# EAGLE design raspberry-alarm-clock-v1 (EAGLE 5.12)

## Sheet 1 of 7
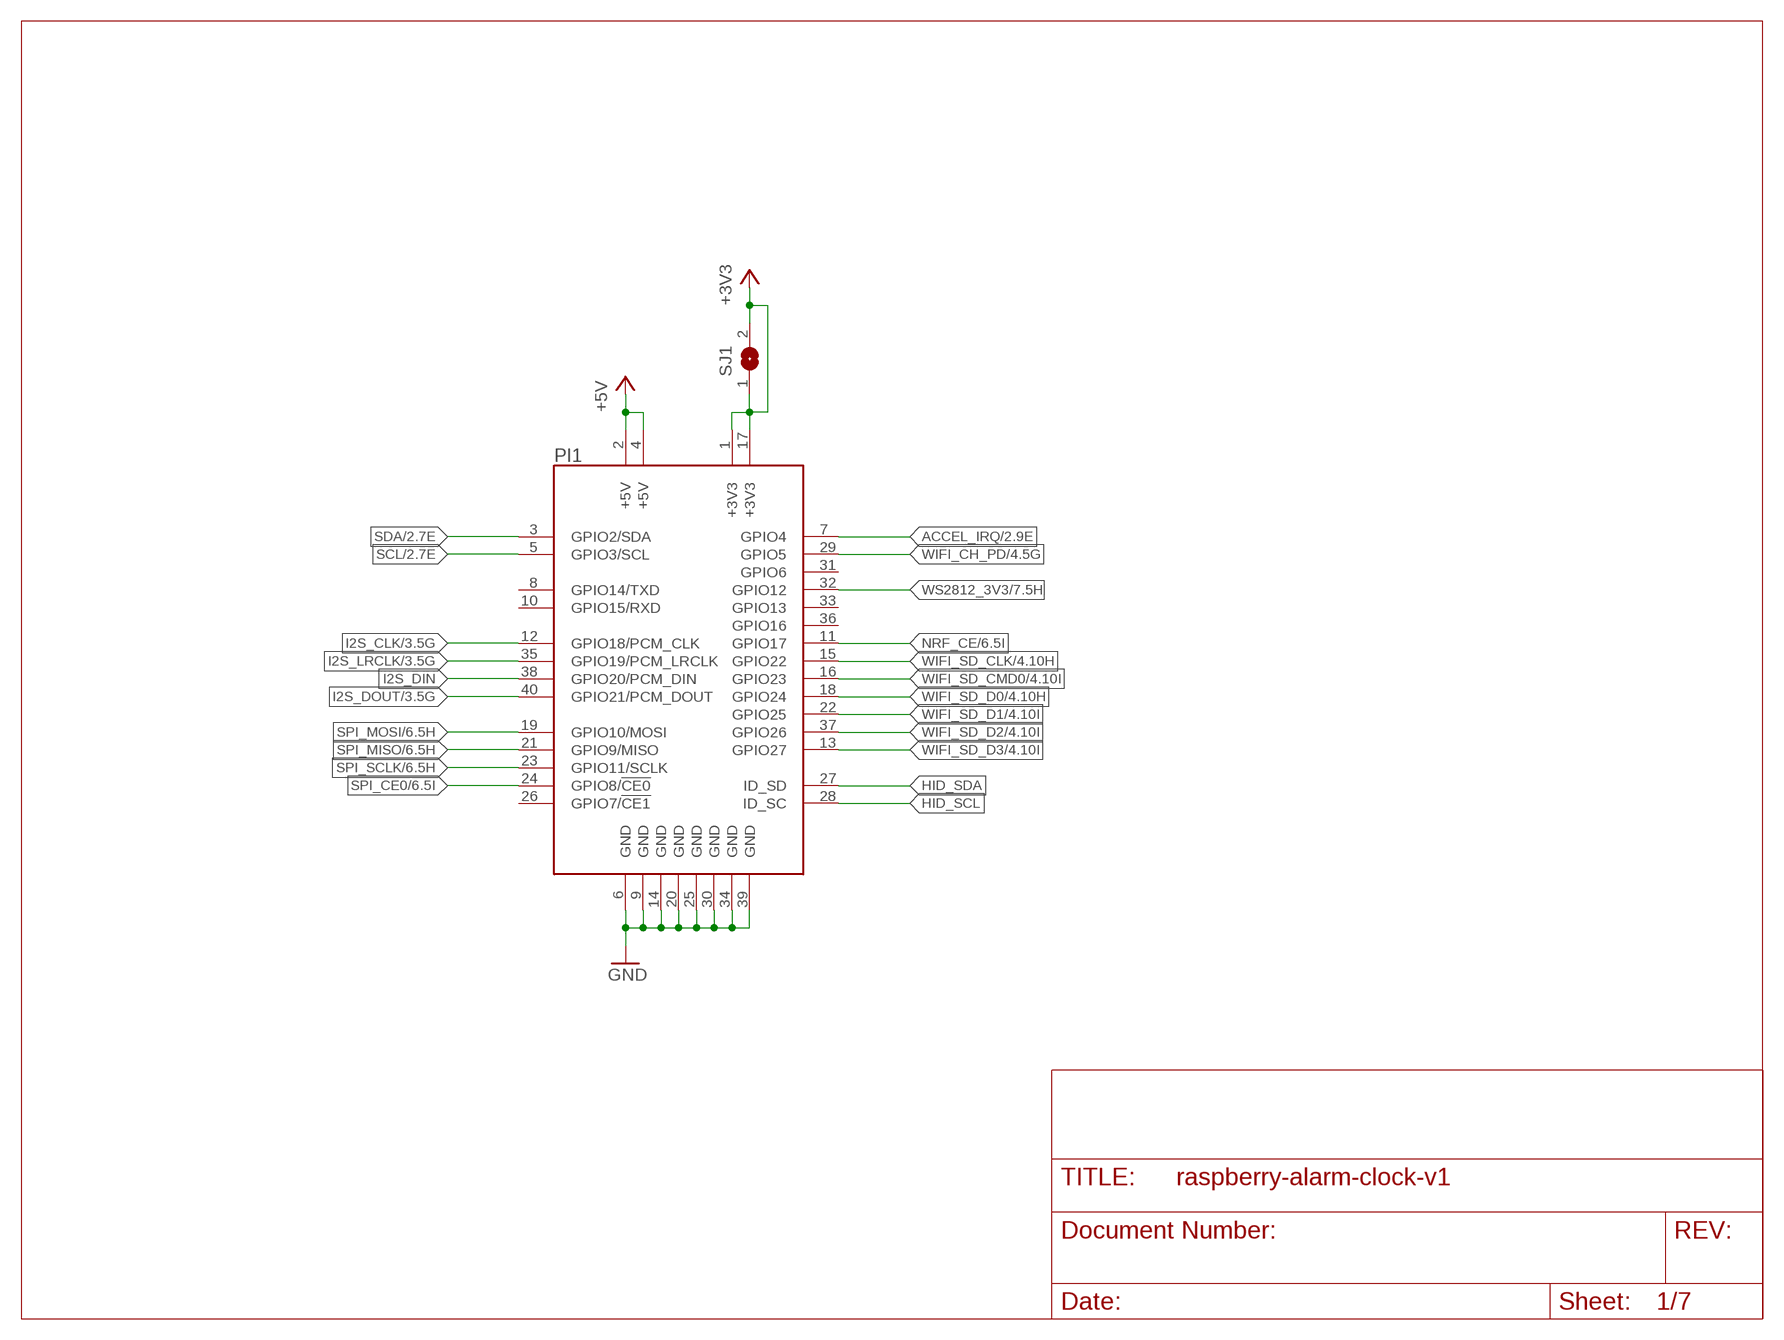
[diagram p0: schematic, sheet 1]

### Parts
PI1  PIHAT-REVERSE-COMBO  [PIHAT-REVERSE-COMBO]
SJ1  SJ  [SJ]

### Nets
+3V3: PI1.1(+3V3) PI1.17(+3V3) SJ1.1 SJ1.2 ; also sheet 2,4,6
+5V: PI1.2(+5V) PI1.4(+5V) ; also sheet 3,5,7
ACCEL_IRQ: PI1.7(GPIO4) ; also sheet 2
GND: PI1.6(GND) PI1.9(GND) PI1.14(GND) PI1.20(GND) PI1.25(GND) PI1.30(GND) PI1.34(GND) PI1.39(GND) ; also sheet 2,3,4,5,6,7
HID_SCL: PI1.28(ID_SC)
HID_SDA: PI1.27(ID_SD)
I2S_CLK: PI1.12(GPIO18/PCM_CLK) ; also sheet 3
I2S_DIN: PI1.38(GPIO20/PCM_DIN)
I2S_DOUT: PI1.40(GPIO21/PCM_DOUT) ; also sheet 3
I2S_LRCLK: PI1.35(GPIO19/PCM_LRCLK) ; also sheet 3
NRF_CE: PI1.11(GPIO17) ; also sheet 6
SCL: PI1.5(GPIO3/SCL) ; also sheet 2
SDA: PI1.3(GPIO2/SDA) ; also sheet 2
SPI_CE0: PI1.24(GPIO8/!CE0) ; also sheet 6
SPI_MISO: PI1.21(GPIO9/MISO) ; also sheet 6
SPI_MOSI: PI1.19(GPIO10/MOSI) ; also sheet 6
SPI_SCLK: PI1.23(GPIO11/SCLK) ; also sheet 6
WIFI_CH_PD: PI1.29(GPIO5) ; also sheet 4
WIFI_SD_CLK: PI1.15(GPIO22) ; also sheet 4
WIFI_SD_CMD0: PI1.16(GPIO23) ; also sheet 4
WIFI_SD_D0: PI1.18(GPIO24) ; also sheet 4
WIFI_SD_D1: PI1.22(GPIO25) ; also sheet 4
WIFI_SD_D2: PI1.37(GPIO26) ; also sheet 4
WIFI_SD_D3: PI1.13(GPIO27) ; also sheet 4
WS2812_3V3: PI1.32(GPIO12) ; also sheet 7
Unconnected: PI1.8(GPIO14/TXD) PI1.10(GPIO15/RXD) PI1.26(GPIO7/!CE1) PI1.31(GPIO6) PI1.33(GPIO13) PI1.36(GPIO16)

## Sheet 2 of 7
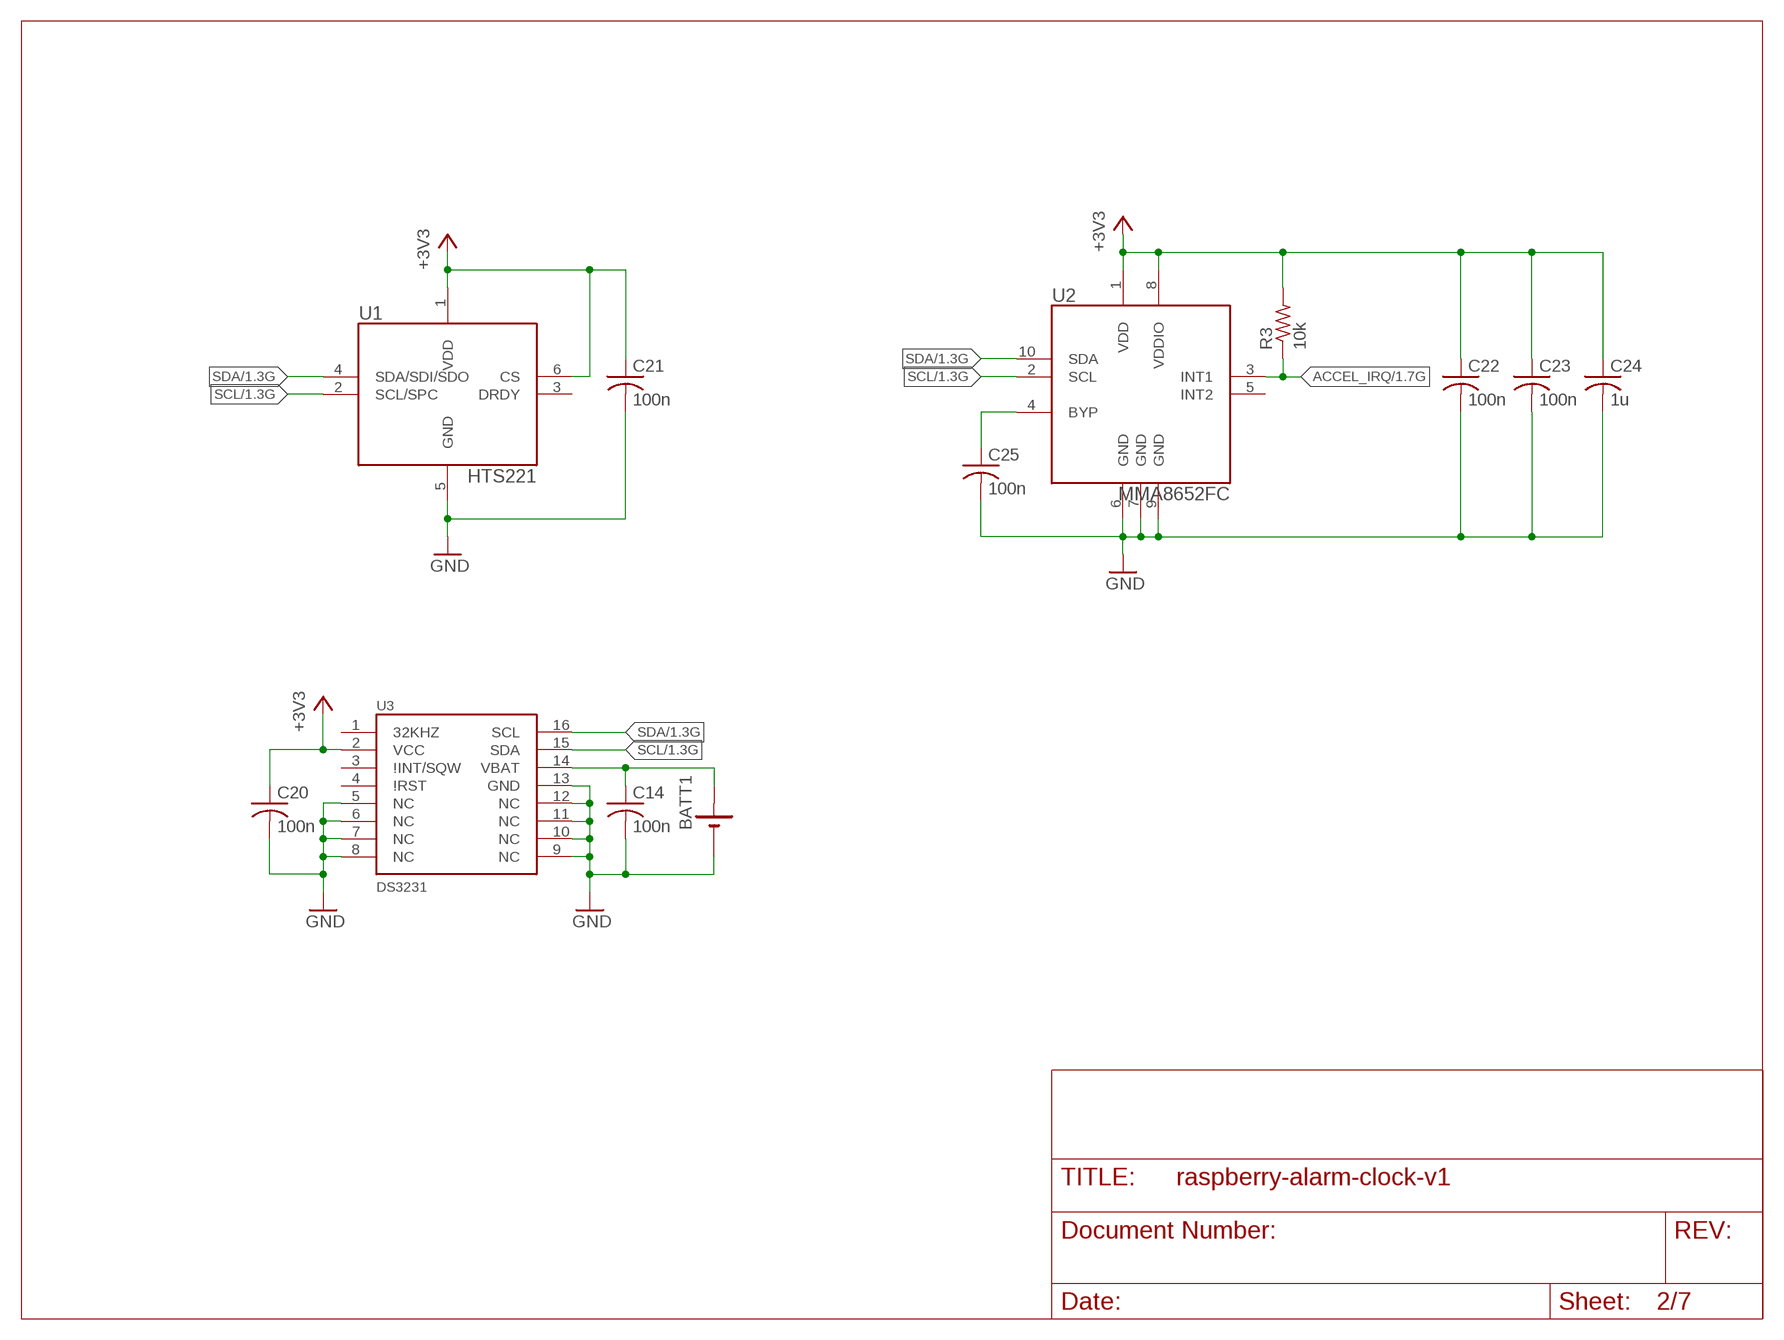
[diagram p1: schematic, sheet 2]

### Parts
BATT1  2032SMD  [2032SMD]
C14  100n  C-USC0603  [C0603]
C20  100n  C-USC0603  [C0603]
C21  100n  C-USC0603  [C0603]
C22  100n  C-USC0603  [C0603]
C23  100n  C-USC0603  [C0603]
C24  1u  C-USC0603  [C0603]
C25  100n  C-USC0603  [C0603]
R3  10k  R-US_R0603  [R0603]
U1  HTS221  [HLGA-6L]
U2  MMA8652FC  [DFN-10]
U3  DS3231  [SO16W]

### Nets
+3V3: C20.1 C21.1 C22.1 C23.1 C24.1 R3.2 U1.1(VDD) U1.6(CS) U2.1(VDD) U2.8(VDDIO) U3.2(VCC) ; also sheet 1,4,6
ACCEL_IRQ: R3.1 U2.3(INT1) ; also sheet 1
GND: BATT1.- C14.2 C20.2 C21.2 C22.2 C23.2 C24.2 C25.2 U1.5(GND) U2.6(GND) U2.7(GND) U2.9(GND) U3.5(NC) U3.6(NC) U3.7(NC) U3.8(NC) U3.9(NC) U3.10(NC) U3.11(NC) U3.12(NC) U3.13(GND) ; also sheet 1,3,4,5,6,7
N$16: BATT1.+ C14.1 U3.14(VBAT)
N$17: C25.1 U2.4(BYP)
SCL: U1.2(SCL/SPC) U2.2(SCL) U3.15(SDA) ; also sheet 1
SDA: U1.4(SDA/SDI/SDO) U2.10(SDA) U3.16(SCL) ; also sheet 1
Unconnected: U1.3(DRDY) U2.5(INT2) U3.1(32KHZ) U3.3(\!INT/SQW) U3.4(\!RST)

## Sheet 3 of 7
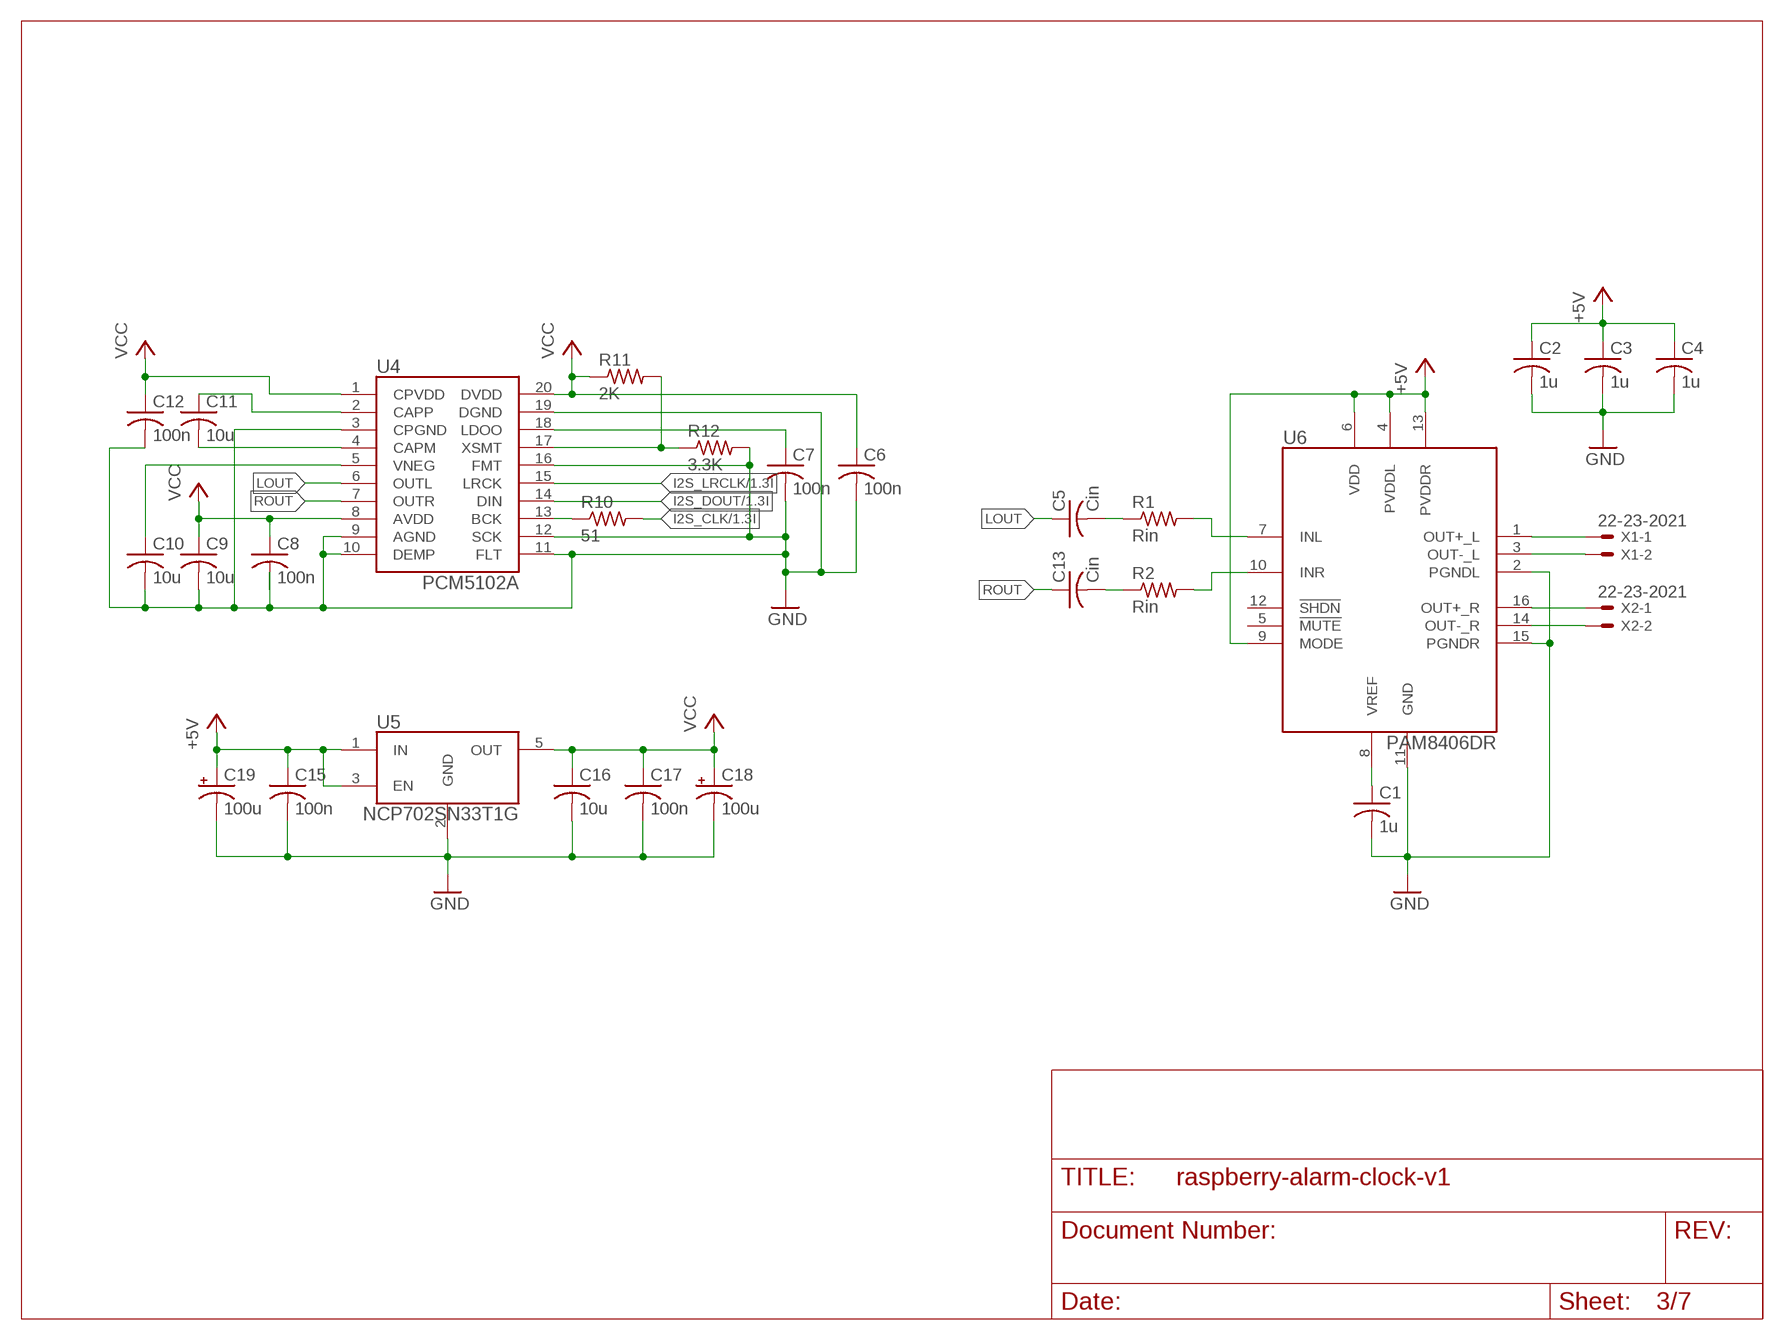
[diagram p2: schematic, sheet 3]

### Parts
C1  1u  C-USC0603  [C0603]
C2  1u  C-USC0603  [C0603]
C3  1u  C-USC0603  [C0603]
C4  1u  C-USC0603  [C0603]
C5  Cin  C-USC0603  [C0603]
C6  100n  C-USC0603  [C0603]
C7  100n  C-USC0603  [C0603]
C8  100n  C-USC0603  [C0603]
C9  10u  C-USC0805  [C0805]
C10  10u  C-USC0805  [C0805]
C11  10u  C-USC0805  [C0805]
C12  100n  C-USC0603  [C0603]
C13  Cin  C-USC0603  [C0603]
C15  100n  C-USC0603  [C0603]
C16  10u  C-USC0805  [C0805]
C17  100n  C-USC0603  [C0603]
C18  100u  CPOL-USC  [PANASONIC_C]
C19  100u  CPOL-USC  [PANASONIC_C]
R1  Rin  R-US_R0603  [R0603]
R2  Rin  R-US_R0603  [R0603]
R10  51  R-US_R0603  [R0603]
R11  2K  R-US_R0603  [R0603]
R12  3.3K  R-US_R0603  [R0603]
U4  PCM5102A  [PW20]
U5  NCP702SN33T1G  [TSOP5]
U6  PAM8406DR  [SO16]
X1  22-23-2021  [22-23-2021]
X2  22-23-2021  [22-23-2021]

### Nets
+5V: C2.1 C3.1 C4.1 C15.1 C19.+ U5.1(IN) U5.3(EN) U6.4(PVDDL) U6.6(VDD) U6.9(MODE) U6.13(PVDDR) ; also sheet 1,5,7
GND: C1.2 C2.2 C3.2 C4.2 C6.2 C7.2 C8.2 C9.2 C10.2 C12.2 C15.2 C16.2 C17.2 C18.- C19.- R12.2 U4.3(CPGND) U4.9(AGND) U4.10(DEMP) U4.11(FLT) U4.12(SCK) U4.16(FMT) U4.19(DGND) U5.2(GND) U6.2(PGNDL) U6.11(GND) U6.15(PGNDR) ; also sheet 1,2,4,5,6,7
I2S_CLK: R10.2 ; also sheet 1
I2S_DOUT: U4.14(DIN) ; also sheet 1
I2S_LRCLK: U4.15(LRCK) ; also sheet 1
LOUT: C5.1 U4.6(OUTL)
N$1: U6.1(OUT+_L) X1.1
N$2: U6.3(OUT-_L) X1.2
N$3: C1.1 U6.8(VREF)
N$4: U6.16(OUT+_R) X2.1
N$5: U6.14(OUT-_R) X2.2
N$6: R2.2 U6.10(INR)
N$7: C7.1 U4.18(LDOO)
N$8: R10.1 U4.13(BCK)
N$9: R11.2 R12.1 U4.17(XSMT)
N$10: R1.2 U6.7(INL)
N$11: C5.2 R1.1
N$12: C13.2 R2.1
N$13: C10.1 U4.5(VNEG)
N$14: C11.2 U4.4(CAPM)
N$15: C11.1 U4.2(CAPP)
ROUT: C13.1 U4.7(OUTR)
VCC: C6.1 C8.1 C9.1 C12.1 C16.1 C17.1 C18.+ R11.1 U4.1(CPVDD) U4.8(AVDD) U4.20(DVDD) U5.5(OUT)
Unconnected: U6.5(!MUTE) U6.12(!SHDN)

## Sheet 4 of 7
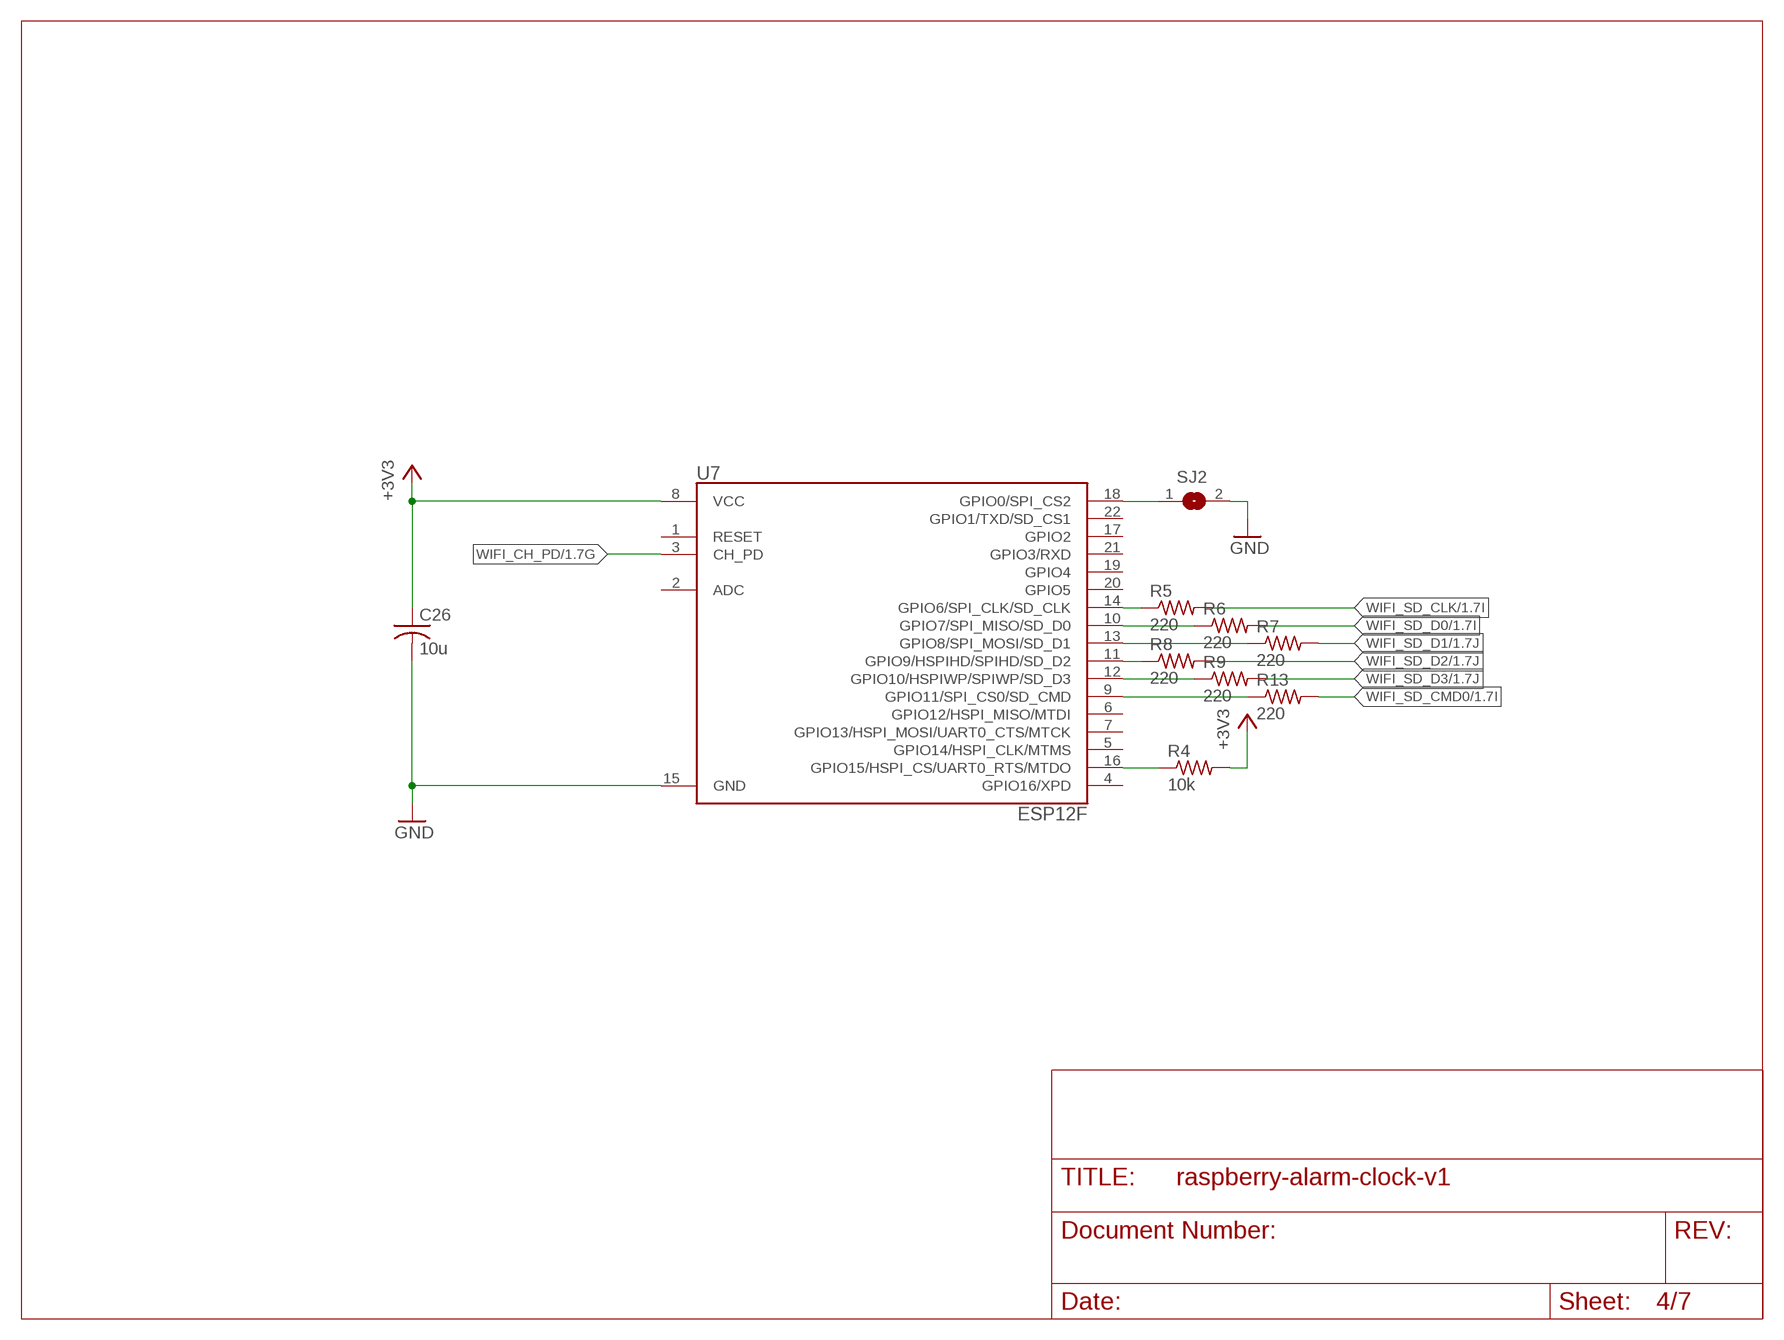
[diagram p3: schematic, sheet 4]

### Parts
C26  10u  C-USC0805  [C0805]
R4  10k  R-US_R0603  [R0603]
R5  220  R-US_R0603  [R0603]
R6  220  R-US_R0603  [R0603]
R7  220  R-US_R0603  [R0603]
R8  220  R-US_R0603  [R0603]
R9  220  R-US_R0603  [R0603]
R13  220  R-US_R0603  [R0603]
SJ2  SJ  [SJ]
U7  ESP12F  [ESP12F]

### Nets
+3V3: C26.1 R4.2 U7.8(VCC) ; also sheet 1,2,6
GND: C26.2 SJ2.2 U7.15(GND) ; also sheet 1,2,3,5,6,7
N$18: R6.1 U7.10(GPIO7/SPI_MISO/SD_D0)
N$19: R7.1 U7.13(GPIO8/SPI_MOSI/SD_D1)
N$20: R5.1 U7.14(GPIO6/SPI_CLK/SD_CLK)
N$21: R8.1 U7.11(GPIO9/HSPIHD/SPIHD/SD_D2)
N$22: R9.1 U7.12(GPIO10/HSPIWP/SPIWP/SD_D3)
N$23: R13.1 U7.9(GPIO11/SPI_CS0/SD_CMD)
N$24: R4.1 U7.16(GPIO15/HSPI_CS/UART0_RTS/MTDO)
N$25: SJ2.1 U7.18(GPIO0/SPI_CS2)
WIFI_CH_PD: U7.3(CH_PD) ; also sheet 1
WIFI_SD_CLK: R5.2 ; also sheet 1
WIFI_SD_CMD0: R13.2 ; also sheet 1
WIFI_SD_D0: R6.2 ; also sheet 1
WIFI_SD_D1: R7.2 ; also sheet 1
WIFI_SD_D2: R8.2 ; also sheet 1
WIFI_SD_D3: R9.2 ; also sheet 1
Unconnected: U7.1(RESET) U7.2(ADC) U7.4(GPIO16/XPD) U7.5(GPIO14/HSPI_CLK/MTMS) U7.6(GPIO12/HSPI_MISO/MTDI) U7.7(GPIO13/HSPI_MOSI/UART0_CTS/MTCK) U7.17(GPIO2) U7.19(GPIO4) U7.20(GPIO5) U7.21(GPIO3/RXD) U7.22(GPIO1/TXD/SD_CS1)

## Sheet 5 of 7
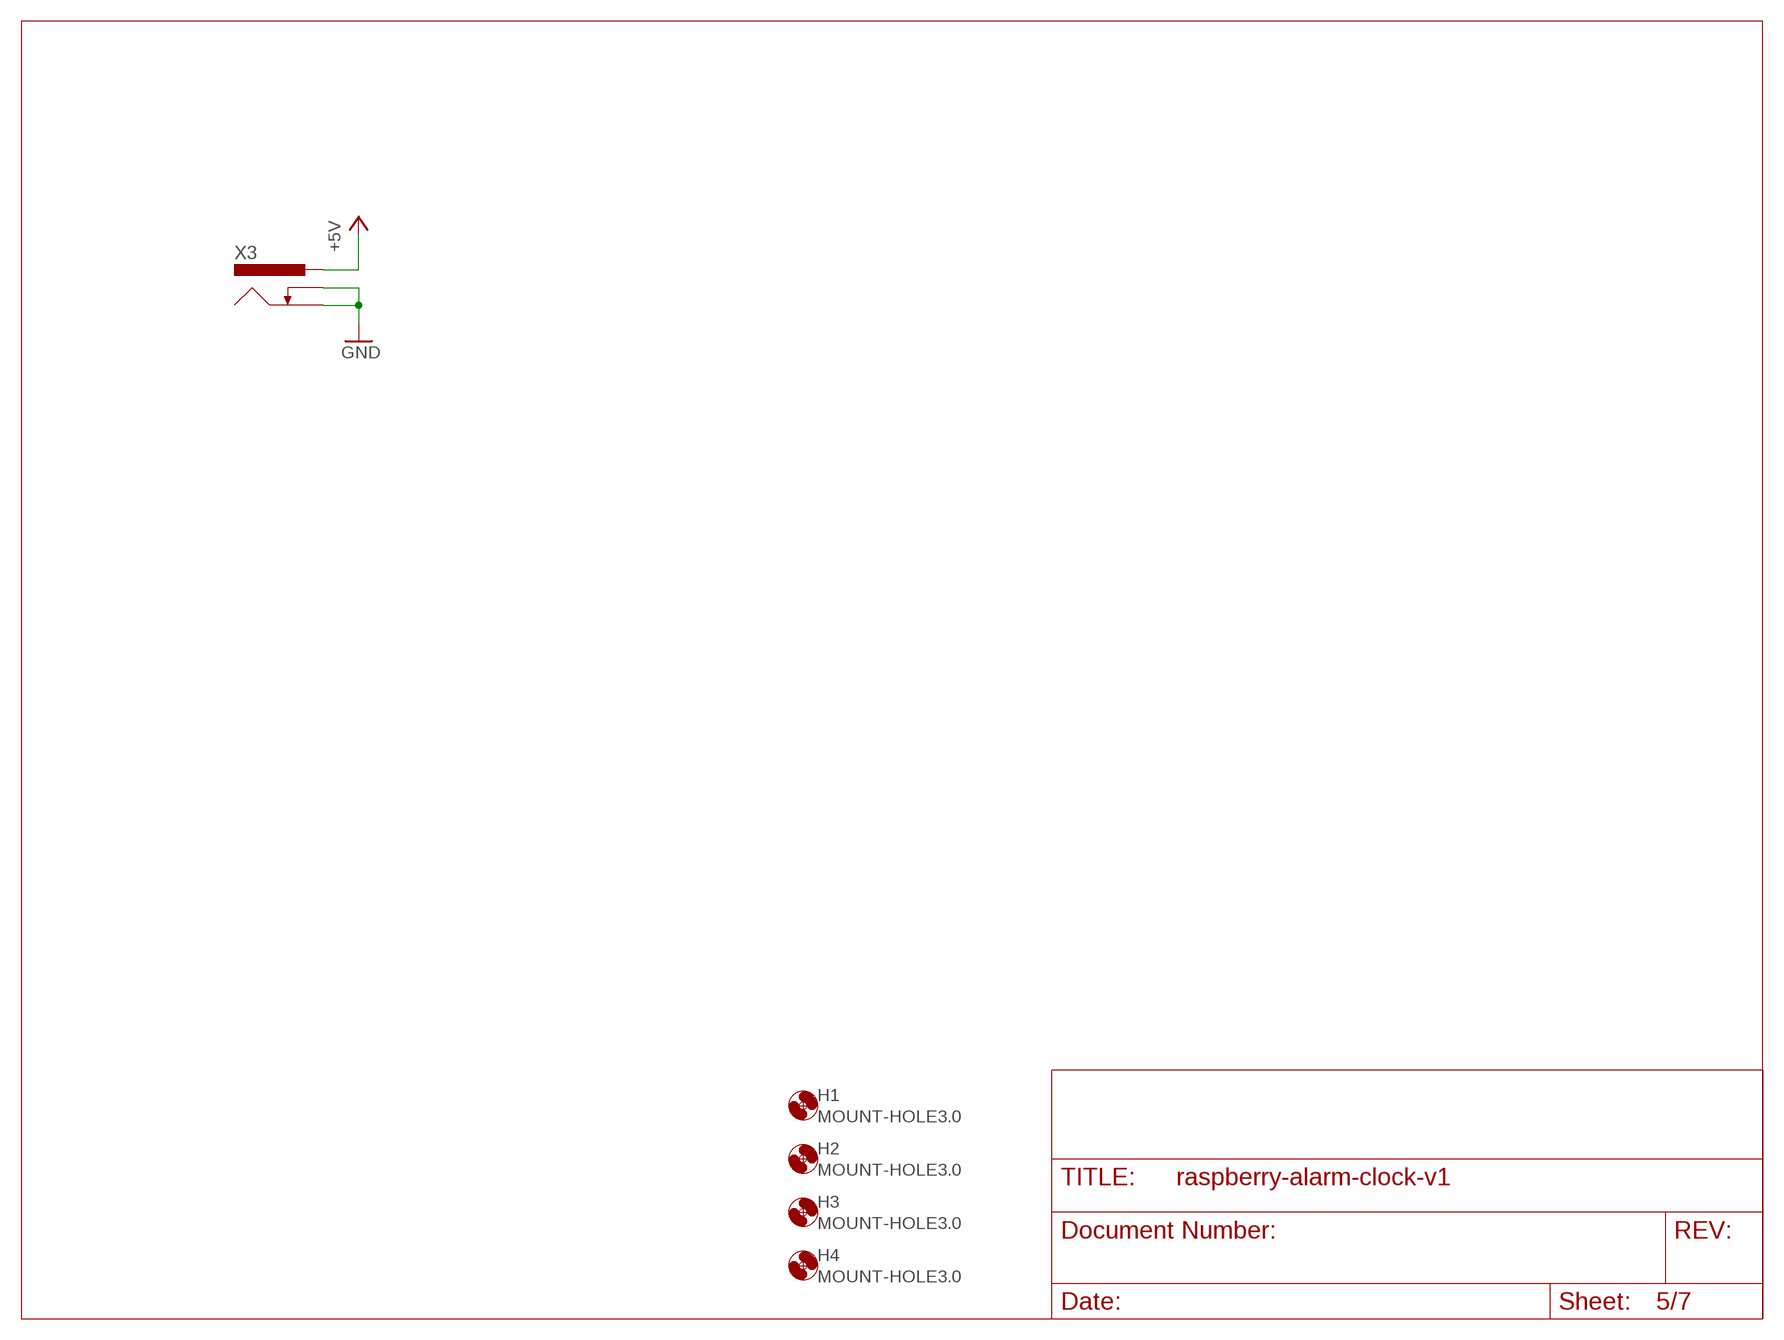
[diagram p4: schematic, sheet 5]

### Parts
H1  MOUNT-HOLE3.0  [3,0]
H2  MOUNT-HOLE3.0  [3,0]
H3  MOUNT-HOLE3.0  [3,0]
H4  MOUNT-HOLE3.0  [3,0]
X3  PJ-002-SMTBH  [PJ-002-SMT]

### Nets
+5V: X3.1A ; also sheet 1,3,7
GND: X3.2 X3.3 ; also sheet 1,2,3,4,6,7

## Sheet 6 of 7
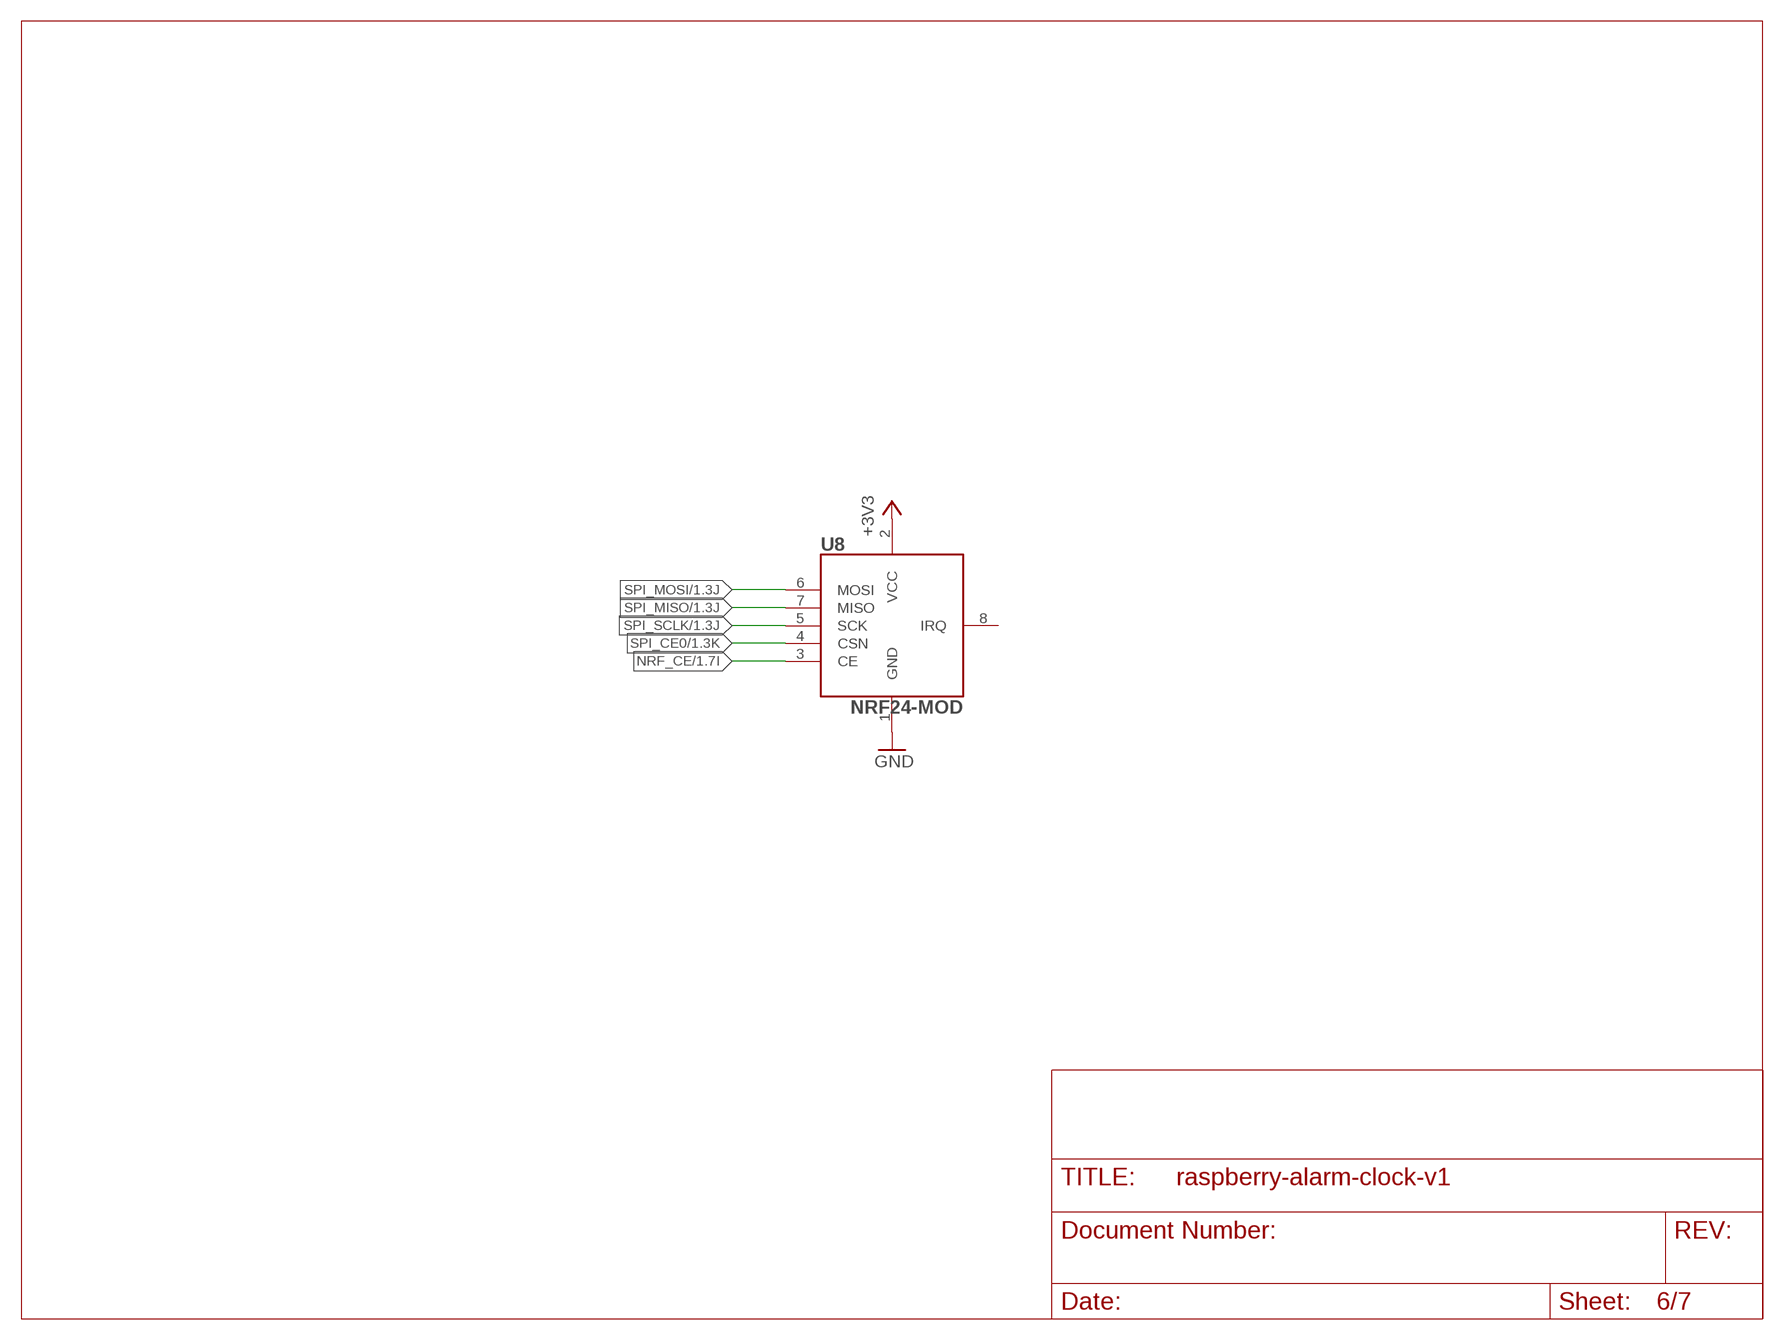
[diagram p5: schematic, sheet 6]

### Parts
U8  NRF24-MOD  [NRF24+PA+LNA_V2]

### Nets
+3V3: U8.2(VCC) ; also sheet 1,2,4
GND: U8.1(GND) ; also sheet 1,2,3,4,5,7
NRF_CE: U8.3(CE) ; also sheet 1
SPI_CE0: U8.4(CSN) ; also sheet 1
SPI_MISO: U8.7(MISO) ; also sheet 1
SPI_MOSI: U8.6(MOSI) ; also sheet 1
SPI_SCLK: U8.5(SCK) ; also sheet 1
Unconnected: U8.8(IRQ)

## Sheet 7 of 7
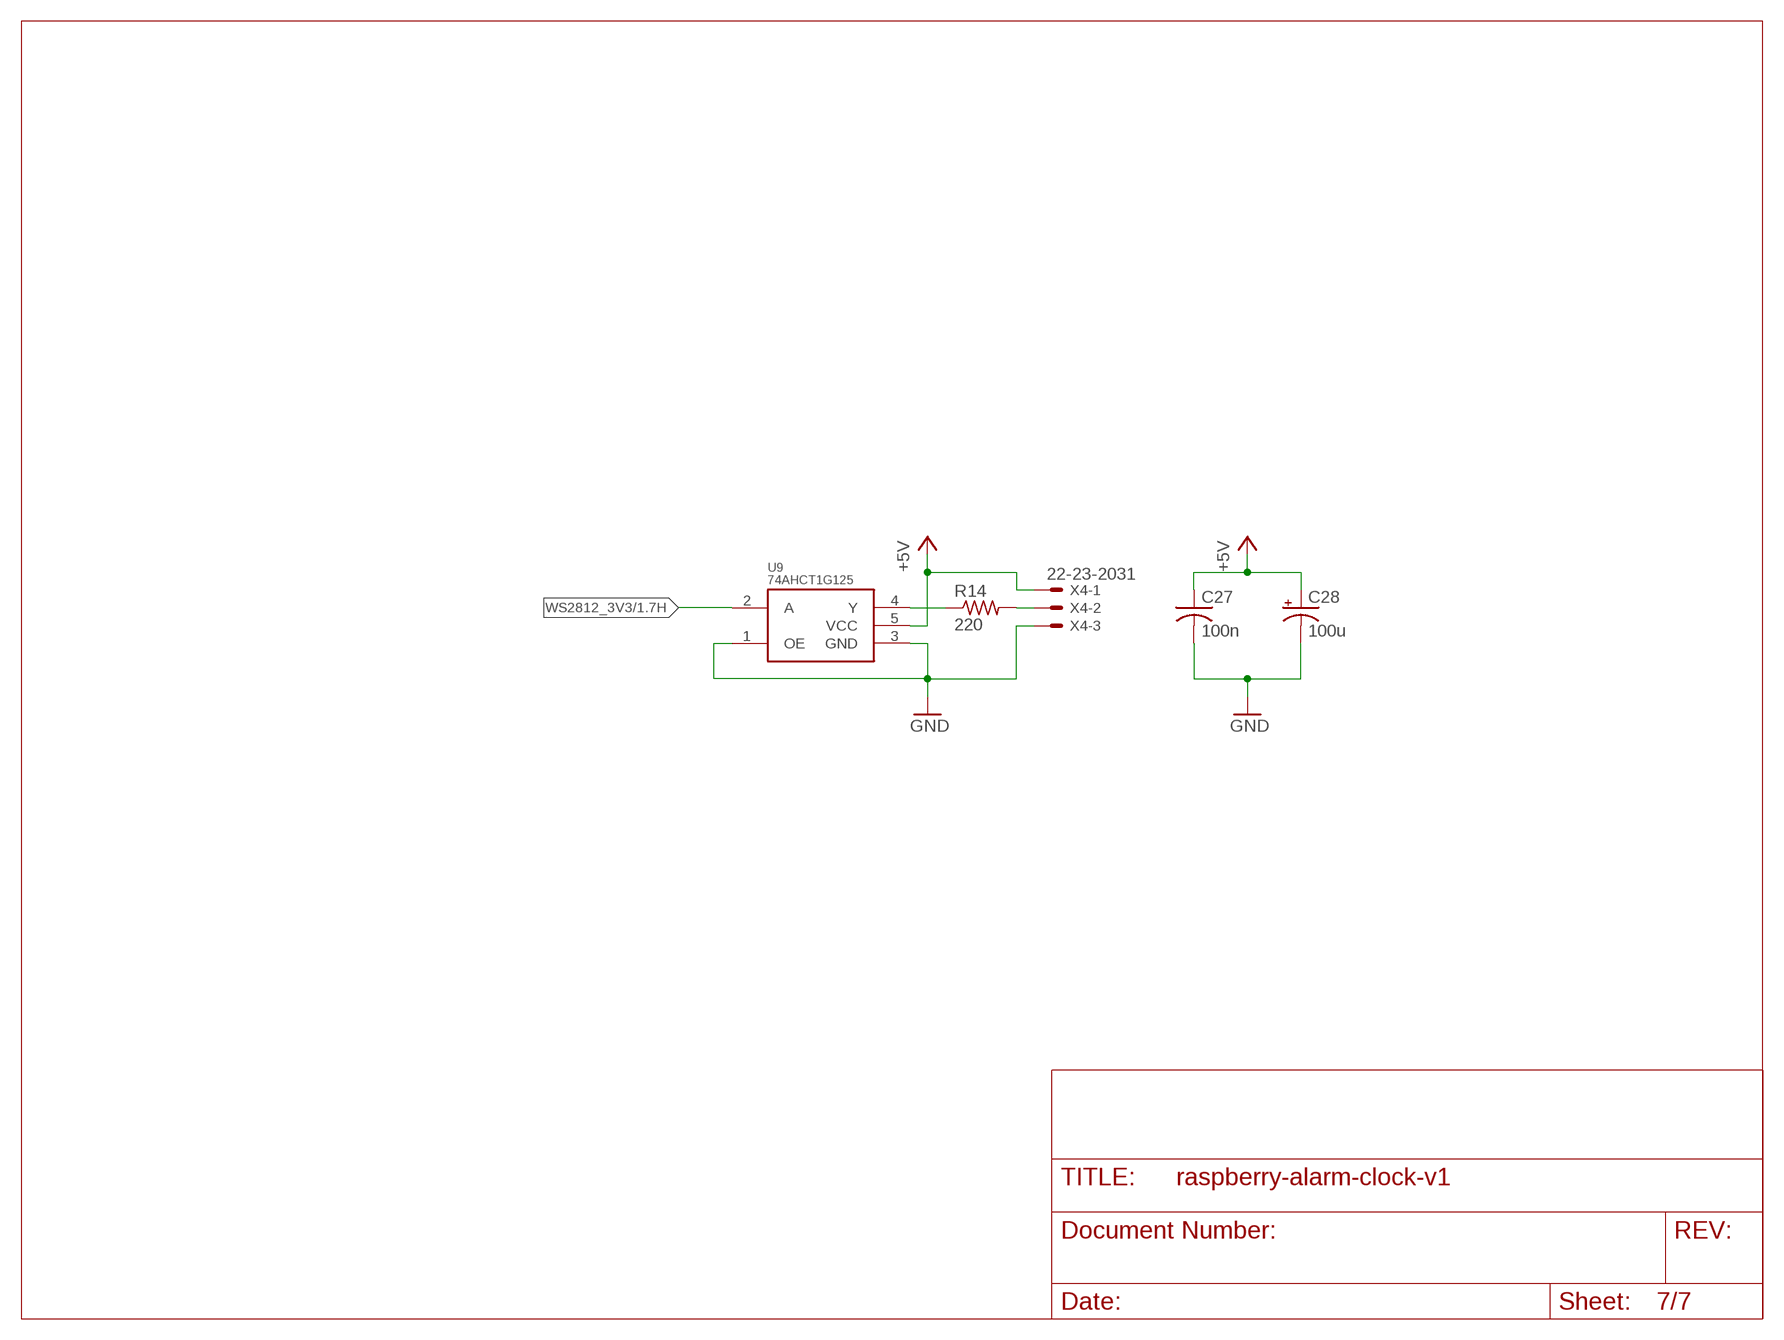
[diagram p6: schematic, sheet 7]

### Parts
C27  100n  C-USC0603  [C0603]
C28  100u  CPOL-USC  [PANASONIC_C]
R14  220  R-US_R0603  [R0603]
U9  74AHCT1G125  74LVC1G125  [SOT-23-5]
X4  22-23-2031  [22-23-2031]

### Nets
+5V: C27.1 C28.+ U9.5(VCC) X4.1 ; also sheet 1,3,5
GND: C27.2 C28.- U9.1(OE) U9.3(GND) X4.3 ; also sheet 1,2,3,4,5,6
N$26: R14.1 U9.4(Y)
N$27: R14.2 X4.2
WS2812_3V3: U9.2(A) ; also sheet 1

## Power pins joined to a net without a drawn wire
1B: X3.1B

## Library data of the parts
BATT1 = rbg-4ucon-battery:2032SMD
C1-C17 C20-C27 = rcl:C-US: CAPACITOR, American symbol
C18 C19 C28 = rcl:CPOL-US: POLARIZED CAPACITOR, American symbol
H1-H4 = holes:MOUNT-HOLE: MOUNTING HOLE with drill center marker
PI1 = pihat:PIHAT
R1-R14 = rcl:R-US_: RESISTOR, American symbol
SJ1 SJ2 = jumper:SJ: SMD solder JUMPER
U1 = puck-parts:HTS221
U2 = puck-parts:MMA8652FC
U3 = DS3231:DS3231
U4 = rbg-ti-dac:PCM5102A
U5 = rbg-onsemi-vreg:NCP702SN33T1G
U6 = rbg-diodesinc-audioamp:PAM8406
U7 = rbg-expressif-esp8266b:ESP12F
U8 = rbg-nordic-nrf24:NRF24-MOD
U9 = dp_devices:74LVC1G125
X1 X2 = con-molex:22-23-2021: .100" (2.54mm) Center Header - 2 Pin; MF: MOLEX; MPN: 22-23-2021; OC_FARNELL: 1462926; OC_NEWARK: 25C3832
X3 = rbg-cui-dcpower:PJ-002-SMT
X4 = con-molex:22-23-2031: .100" (2.54mm) Center Header - 3 Pin; MF: MOLEX; MPN: 22-23-2031; OC_FARNELL: 1462950; OC_NEWARK: 30C0862

## Board
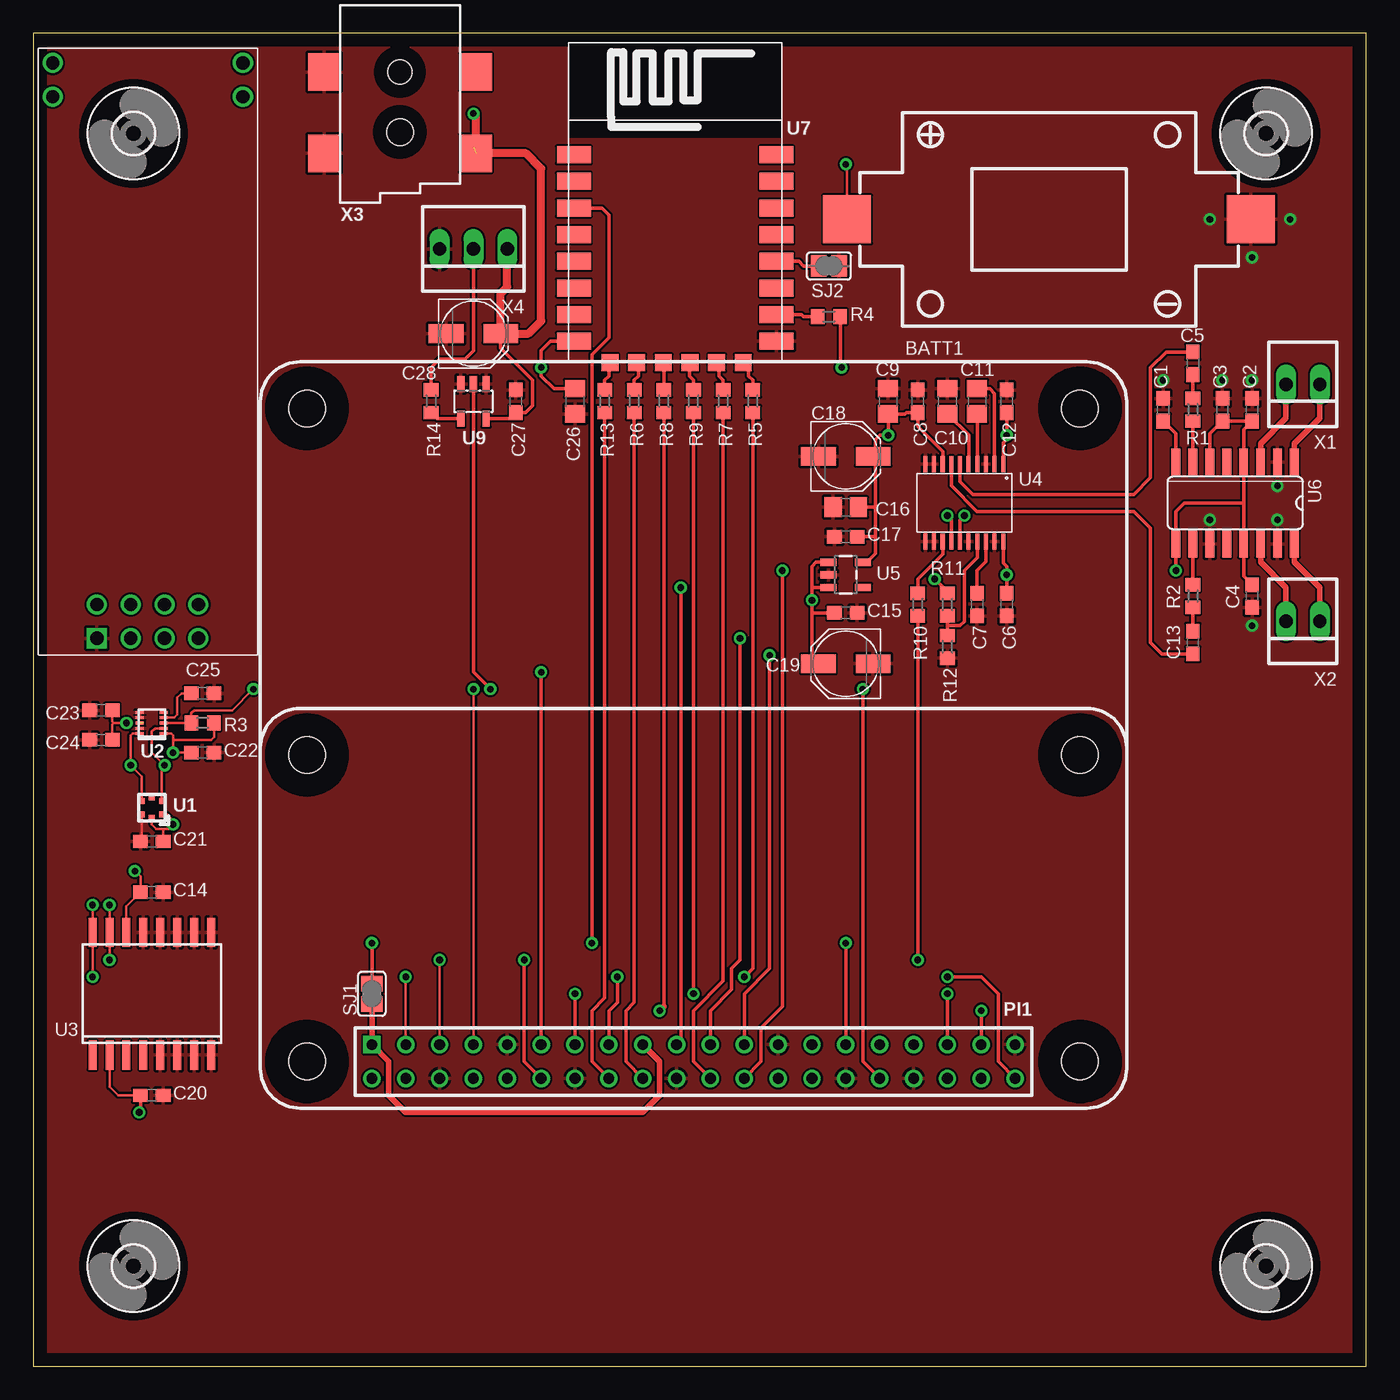
[diagram p7: board, top side]
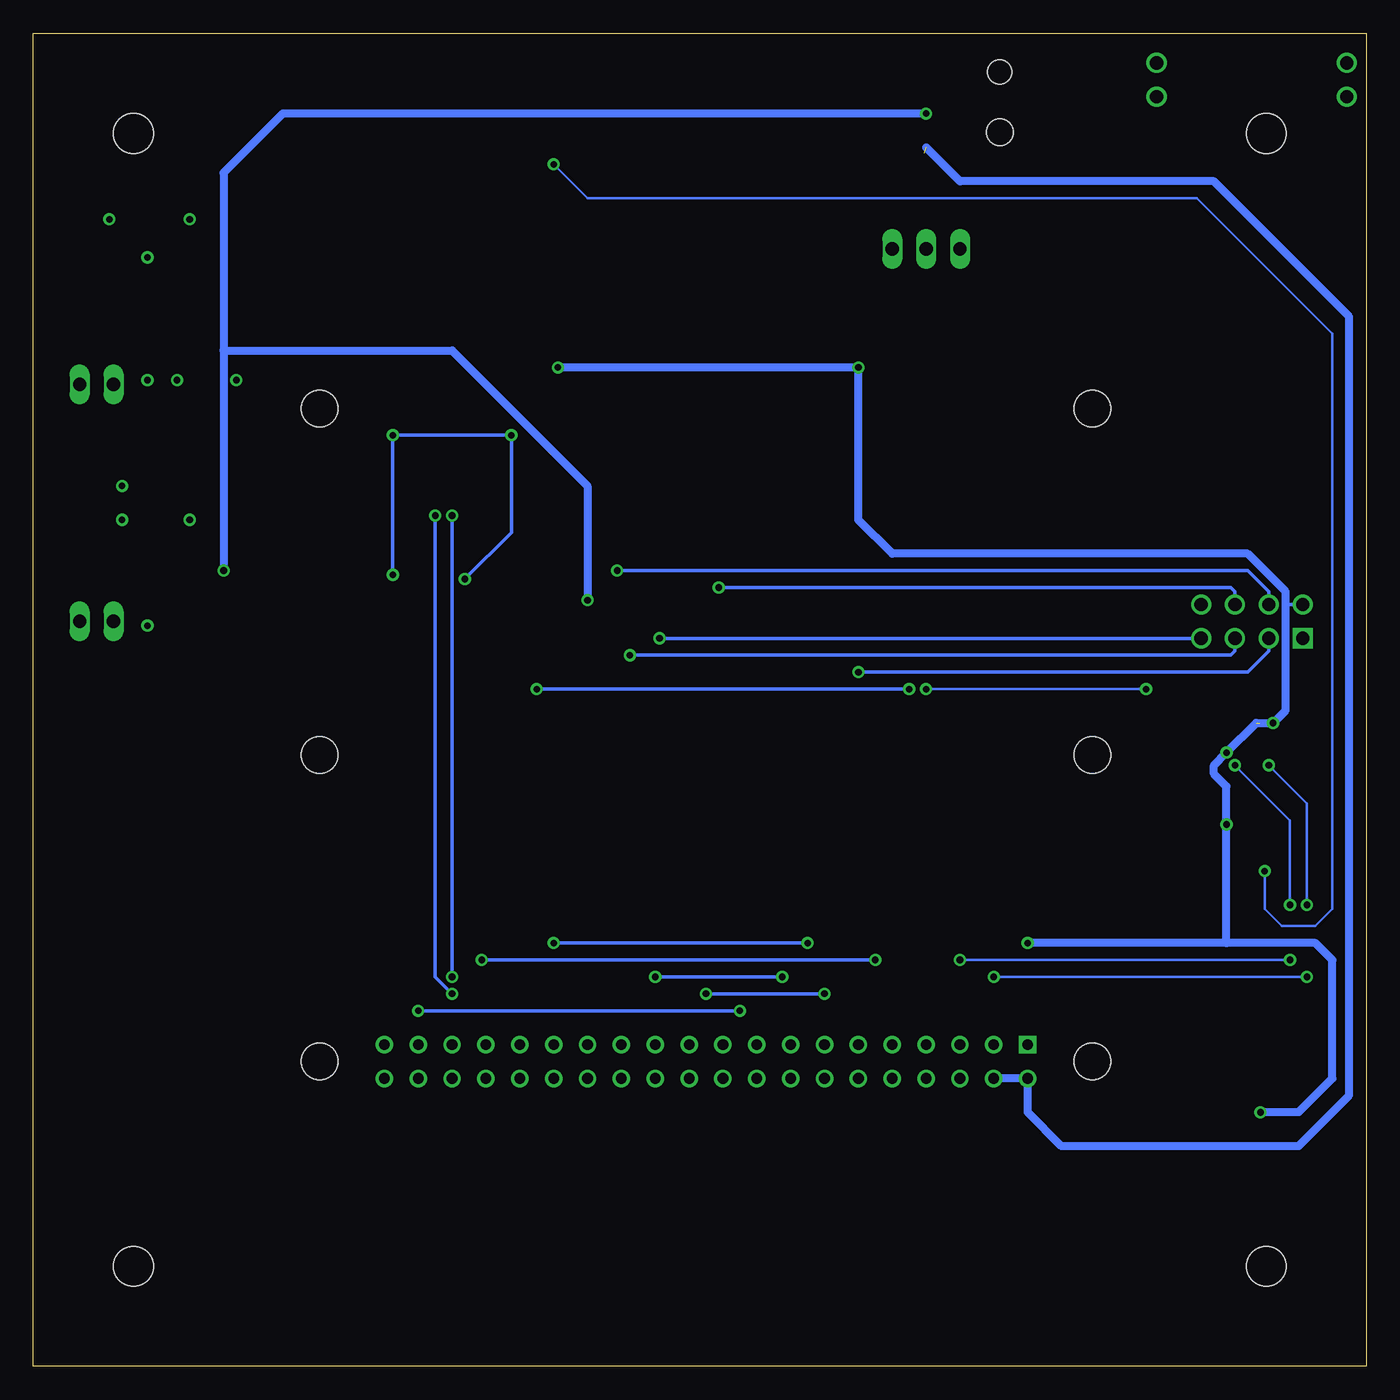
[diagram p8: board, bottom side, seen from below]

Size 100 x 100 mm. Coordinates in mm from the lower left corner, seen from the top.
Outline: 0,0 100,0 100,100 0,100 0,0
Copper layers (1*16): Top 0.035mm / dielectric 1.5mm / Bottom 0.035mm
Design rules "default *": minimum track width 6mil, minimum drill 18mil, track to track 6mil, track to pad 6mil, pad to pad 6mil, via to via 6mil, smd to smd 6mil, copper to edge 40mil, drill to drill 8mil, minimum pad ring 10mil, minimum via ring 8mil, stop-mask expansion 4mil, vias tented up to drill 0mil, thermal gap 8mil

### Footprints (pad centres in the part's own frame; a part is rotated, then mirrored left to right if it is on the bottom)
2032SMD = smd 3.6 x 3.6: + -15.15,0; - 15.15,0
C0603 = smd 1.1 x 1: 1 -0.85,0; 2 0.85,0
C0805 = smd 1.3 x 1.5: 1 -0.95,0; 2 0.95,0
PANASONIC_C = smd 2.6 x 1.4: + 2.05,0; - -2.05,0
3,0 = hole 3: 0,0
PIHAT-REVERSE-COMBO = drill 0.8 square: 1 57.15,52.07 | drill 0.8 round: 2 57.15,54.61; 3 54.61,52.07; 4 54.61,54.61; 5 52.07,52.07; 6 52.07,54.61; 7 49.53,52.07; 8 49.53,54.61; 9 46.99,52.07; 10 46.99,54.61; 11 44.45,52.07; 12 44.45,54.61; 13 41.91,52.07; 14 41.91,54.61; 15 39.37,52.07; 16 39.37,54.61; 17 36.83,52.07; 18 36.83,54.61; 19 34.29,52.07; 20 34.29,54.61; 21 31.75,52.07; 22 31.75,54.61; 23 29.21,52.07; 24 29.21,54.61; 25 26.67,52.07; 26 26.67,54.61; 27 24.13,52.07; 28 24.13,54.61; 29 21.59,52.07; 30 21.59,54.61; 31 19.05,52.07; 32 19.05,54.61; 33 16.51,52.07; 34 16.51,54.61; 35 13.97,52.07; 36 13.97,54.61; 37 11.43,52.07; 38 11.43,54.61; 39 8.89,52.07; 40 8.89,54.61 | hole 2.75: 62.02,4.34; 62.02,53.34; 4.02,4.34; 4.02,53.34; 4.02,30.34; 62.02,30.34
R0603 = smd 1 x 1.1: 1 -0.85,0; 2 0.85,0
SJ = smd 1.168 x 1.6: 1 -0.762,0; 2 0.762,0
HLGA-6L = smd 0.4 x 0.45: 1 -0.75,0.5; 2 -0.75,-0.5; 4 0.75,-0.5; 5 0.75,0.5 | smd 0.45 x 0.4: 3 0,-0.75; 6 0,0.75
DFN-10 = smd 0.6 x 0.225: 1 -0.9,0.8; 2 -0.9,0.4; 3 -0.9,0; 4 -0.9,-0.4; 5 -0.9,-0.8; 6 0.9,-0.8; 7 0.9,-0.4; 8 0.9,0; 9 0.9,0.4; 10 0.9,0.8
SO16W = smd 0.6 x 2.2: 1 -4.445,-4.6; 2 -3.175,-4.6; 3 -1.905,-4.6; 4 -0.635,-4.6; 5 0.635,-4.6; 6 1.905,-4.6; 7 3.175,-4.6; 8 4.445,-4.6; 9 4.445,4.6; 10 3.175,4.6; 11 1.905,4.6; 12 0.635,4.6; 13 -0.635,4.6; 14 -1.905,4.6; 15 -3.175,4.6; 16 -4.445,4.6
PW20 = smd 0.3 x 1.2: 1 -2.925,-2.9; 2 -2.275,-2.9; 3 -1.625,-2.9; 4 -0.975,-2.9; 5 -0.325,-2.9; 6 0.325,-2.9; 7 0.975,-2.9; 8 1.625,-2.9; 9 2.275,-2.9; 10 2.925,-2.9; 11 2.925,2.9; 12 2.275,2.9; 13 1.625,2.9; 14 0.975,2.9; 15 0.325,2.9; 16 -0.325,2.9; 17 -0.975,2.9; 18 -1.625,2.9; 19 -2.275,2.9; 20 -2.925,2.9
TSOP5 = smd 0.55 x 1.2: 1 -0.95,-1.3; 2 0,-1.3; 3 0.95,-1.3; 4 0.95,1.3; 5 -0.95,1.3
SO16 = smd 0.66 x 2.032: 1 -4.445,-3.073; 2 -3.175,-3.073; 3 -1.905,-3.073; 4 -0.635,-3.073; 5 0.635,-3.073; 6 1.905,-3.073; 7 3.175,-3.073; 8 4.445,-3.073; 9 4.445,3.073; 10 3.175,3.073; 11 1.905,3.073; 12 0.635,3.073; 13 -0.635,3.073; 14 -1.905,3.073; 15 -3.175,3.073; 16 -4.445,3.073
ESP12F = smd 2.54 x 1.27: 1 -7.7,5.8; 2 -7.7,3.8; 3 -7.7,1.8; 4 -7.7,-0.2; 5 -7.7,-2.2; 6 -7.7,-4.2; 7 -7.7,-6.2; 8 -7.7,-8.2; 15 7.5,-8.2; 16 7.5,-6.2; 17 7.5,-4.2; 18 7.5,-2.2; 19 7.5,-0.2; 20 7.5,1.8; 21 7.5,3.8; 22 7.5,5.8 | smd 1.27 x 1.27: 9 -5,-9.8; 10 -3,-9.8; 11 -1,-9.8; 12 1,-9.8; 13 3,-9.8; 14 5,-9.8
NRF24+PA+LNA_V2 = drill 1 square: 1 -1.27,3.81 | drill 1 round: 2 1.27,3.81; 3 -1.27,1.27; 4 1.27,1.27; 5 -1.27,-1.27; 6 1.27,-1.27; 7 -1.27,-3.81; 8 1.27,-3.81; M1 39.36,7.11; M2 41.9,7.11; M3 39.36,-7.15; M4 41.9,-7.15
SOT-23-5 = smd 0.55 x 1.2: 1 -0.95,-1.3; 2 0,-1.3; 3 0.95,-1.3; 4 0.95,1.3; 5 -0.95,1.3
22-23-2021 = drill 1 long: 1 -1.27,0; 2 1.27,0
PJ-002-SMT = smd 2.4 x 2.8: 1A 5.7,0; 1B 5.7,6.1; 2 -5.7,6.1; 3 -5.7,0 | hole 1.8: 0,6.1 | hole 2: 0,1.6
22-23-2031 = drill 1 long: 1 -2.54,0; 2 0,0; 3 2.54,0

### Placement (x,y rotation side)
BATT1  76.2,86.04 0 top
C1  84.77,71.75 90 top
C2  91.44,71.75 90 top
C3  89.22,71.75 90 top
C4  91.44,57.78 270 top
C5  87,75.25 270 top
C6  73.03,57.15 270 top
C7  70.8,57.15 270 top
C8  66.36,72.39 90 top
C9  64.14,72.39 90 top
C10  68.58,72.39 90 top
C11  70.8,72.39 270 top
C12  73.03,72.39 90 top
C13  87,54.29 90 top
C14  8.89,35.56 0 top
C15  60.96,56.52 0 top
C16  60.96,64.45 180 top
C17  60.96,62.23 180 top
C18  60.96,68.26 0 top
C19  60.96,52.7 180 top
C20  8.89,20.32 0 top
C21  8.89,39.37 180 top
C22  12.7,46.04 0 top
C23  5.08,49.21 180 top
C24  5.08,46.99 180 top
C25  12.7,50.48 0 top
C26  40.64,72.39 270 top
C27  36.2,72.39 90 top
C28  33.02,77.47 0 top
H1  7.5,92.5 0 top
H2  7.5,7.5 0 top
H3  92.5,92.5 0 top
H4  92.5,7.5 0 top
PI1  82.55,76.2 180 top
R1  87,71.75 270 top
R2  87,57.78 90 top
R3  12.7,48.26 0 top
R4  59.69,78.74 0 top
R5  53.98,72.39 270 top
R6  45.09,72.39 270 top
R7  51.75,72.39 270 top
R8  47.31,72.39 270 top
R9  49.53,72.39 270 top
R10  66.36,57.15 270 top
R11  68.58,57.15 270 top
R12  68.58,53.98 270 top
R13  42.86,72.39 270 top
R14  29.84,72.39 90 top
SJ1  25.4,27.94 90 top
SJ2  59.69,82.55 0 top
U1  8.89,41.91 180 top
U2  8.89,48.26 180 top
U3  8.89,27.94 0 top
U4  69.85,64.77 180 top
U5  60.96,59.37 270 top
U6  90.17,64.77 180 top
U7  48.26,85.09 0 top
U8  8.57,55.88 90 top
U9  33.02,72.39 180 top
X1  95.25,73.66 180 top
X2  95.25,55.88 180 top
X3  27.5,91 0 top
X4  33.02,83.82 180 top

### Tracks (layer width: path | path; a pad name or v marks a point on that pad's centre or on a via)
+3V3  (via drill 0.5)  (1 unrouted)
  Top 0.203: SJ1.2 SJ1.1 | U1.6 8.89,40.64 9.21,40.32 9.84,40.32 | U1.1 10.03,41.41 10.48,40.96 v10.48,40.64 10.16,40.32 9.84,40.32 | C21.1 9.74,40.22 9.84,40.32 | v6.99,48.26 6.03,48.26 | C23.1 5.93,48.36 6.03,48.26 | C24.1 5.93,48.16 6.03,48.26 | C22.1 v10.48,46.04 10.48,46.99 | U2.1 10.32,47.46 10.48,47.31 10.48,46.99 | R3.2 13.55,47.2 13.34,46.99 10.48,46.99 | U3.2 5.71,20.95 6.35,20.32 C20.1
  Top 0.254: U7.8 38.79,76.89 38.1,76.2 v38.1,74.93 38.1,74.3 39.05,73.34 C26.1 | v60.64,74.93 60.54,75.03 R4.2 | C20.1 8.04,19.15 v7.94,19.05 | v25.4,31.75 SJ1.2
  Top 0.406: SJ1.1 PI1.1 26.67,22.86 26.67,20.32 27.94,19.05 45.72,19.05 46.99,20.32 46.99,22.86 PI1.17
  Bottom 0.254: 6.03,57.15 U8.2
  Bottom 0.61: v60.64,74.93 v38.1,74.93 38.1,63.5 35.56,60.96 8.89,60.96 6.03,58.1 6.03,57.15 6.03,49.21 v6.99,48.26 8.26,48.26 v10.48,46.04 11.43,45.09 11.43,44.45 10.48,43.5 v10.48,40.64 10.48,31.75 | 10.48,31.75 3.81,31.75 2.54,30.48 2.54,21.59 5.08,19.05 v7.94,19.05 | 10.48,31.75 v25.4,31.75
+5V  (via drill 0.5)  (1 unrouted)
  Top 0.254: C4.1 90.81,59.27 U6.13 90.81,64.77 | U6.6 88.27,69.95 C3.1 C2.1 90.81,70.27 U6.4 90.81,64.77 | 90.81,64.77 86.36,64.77 85.72,64.14 U6.9 v85.72,59.69 | U5.1 58.73,60.32 58.42,60.01 58.42,58.42 | 58.42,56.52 58.42,53.2 C19.+ | 58.42,56.52 v58.42,57.47 58.42,58.42 | 58.42,56.52 C15.1 | U5.3 58.42,58.42 | U9.5 35.74,71.09 C27.1 36.93,71.54 37.47,72.07 37.47,73.98 35.07,76.37 C28.+
  Top 0.61: v33.02,93.98 33.2,93.8 X3.1A 36.95,91 38.1,89.85 38.1,78.42 37.15,77.47 C28.+ 35.07,80.47 35.56,80.96 X4.1
  Bottom 0.61: PI1.4 PI1.2 25.4,19.05 22.86,16.51 5.08,16.51 1.27,20.32 1.27,78.74 11.43,88.9 30.48,88.9 33.02,91.44 | v33.02,93.98 81.28,93.98 85.72,89.53 85.72,76.2 | 85.72,76.2 v85.72,59.69 | v58.42,57.47 58.42,66.04 68.58,76.2 85.72,76.2
ACCEL_IRQ  (via drill 0.5)
  Top 0.203: U2.3 R3.1 11.85,49 12.06,49.21 14.92,49.21 v16.51,50.8 | v33.02,50.8 PI1.7
  Bottom 0.203: v16.51,50.8 v33.02,50.8
GND  (via drill 0.5)
  Top 0.203: U1.5 8.14,39.47 C21.2
  other vias: 88.27,63.5 93.34,63.5 93.34,66.04 91.44,55.56 91.44,73.98 89.22,73.98 84.77,73.98 94.3,86.04 91.44,83.19 88.27,86.04
  pour Top: 0,100.33 100.33,100.33 100.33,0 0,0
I2S_CLK  (via drill 0.5)
  Top 0.254: v66.36,30.48 R10.2 | v36.83,30.48 36.83,22.86 PI1.12
  Bottom 0.254: v36.83,30.48 v66.36,30.48
I2S_DOUT  (via drill 0.5)
  Top 0.254: U4.14 68.88,63.52 v68.58,63.82 | v68.58,29.21 71.12,29.21 72.39,27.94 72.39,22.86 PI1.40
  Bottom 0.254: v68.58,29.21 v68.58,63.82
I2S_LRCLK  (via drill 0.5)
  Top 0.254: U4.15 69.53,63.49 v69.85,63.82 | PI1.35 v68.58,27.94
  Bottom 0.254: v69.85,63.82 69.85,29.21 v68.58,27.94
LOUT
  Top 0.254: U4.6 69.53,66.36 70.48,65.41 82.55,65.41 83.82,66.67 83.82,74.93 84.99,76.1 C5.1
N$1
  Top 0.406: U6.1 94.61,69.22 96.52,71.12 X1.1
N$2
  Top 0.406: U6.3 92.08,69.22 93.98,71.12 X1.2
N$3
  Top 0.254: U6.8 85.72,69.95 C1.1
N$4
  Top 0.406: U6.16 94.61,60.33 96.52,58.42 X2.1
N$5
  Top 0.406: U6.14 92.08,60.33 93.98,58.42 X2.2
N$6
  Top 0.254: R2.2 U6.10
N$7
  Top 0.254: U4.18 71.47,60.36 70.8,59.69 C7.1
N$8
  Top 0.254: U4.13 68.22,60.92 66.36,59.05 R10.1
N$9
  Top 0.254: U4.17 70.83,60.66 69.85,59.69 69.85,55.88 69.53,55.56 68.58,55.56 | R12.1 68.58,55.56 | 68.58,55.56 R11.2
N$10
  Top 0.254: U6.7 R1.2
N$11
  Top 0.254: R1.1 C5.2
N$12
  Top 0.254: C13.2 R2.1
N$13
  Top 0.254: U4.5 70.17,69.84 C10.1
N$14
  Top 0.254: U4.4 70.83,71.42 C11.2
N$15
  Top 0.254: U4.2 72.12,72.97 71.75,73.34 C11.1
N$16  (via drill 0.5)
  Top 0.203: U3.14 6.99,34.51 C14.1 8.04,36.73 v7.62,37.15 | BATT1.+ 61.05,90.08 v60.96,90.17
  Bottom 0.203: v60.96,90.17 58.42,87.63 12.7,87.63 2.54,77.47 2.54,34.29 3.81,33.02 6.35,33.02 7.62,34.29 v7.62,37.15
N$17
  Top 0.203: U2.4 10.56,48.66 10.79,48.9 10.79,50.16 11.11,50.48 C25.1
N$18
  Top 0.254: R6.1 45.09,73.98 45.4,74.3 45.4,75.15
  Top 0.406: 45.4,75.15 U7.10
N$19
  Top 0.254: R7.1 51.75,73.98 51.44,74.3 51.44,75.11
  Top 0.406: 51.44,75.11 U7.13
N$20
  Top 0.254: R5.1 53.98,73.98 53.66,74.3 53.66,74.89 U7.14
N$21
  Top 0.254: R8.1 47.31,75.24
  Top 0.406: 47.31,75.24 U7.11
N$22
  Top 0.254: R9.1 49.53,73.98 49.21,74.3 49.21,75.24
  Top 0.406: 49.21,75.24 U7.12
N$23
  Top 0.254: R13.1 42.86,73.98 43.18,74.3 43.18,75.21
  Top 0.406: 43.18,75.21 U7.9
N$24
  Top 0.254: U7.16 57.63,78.89 57.78,78.74 R4.1
N$25
  Top 0.254: U7.18 57.45,82.89 57.78,82.55 SJ2.1
N$26
  Top 0.254: U9.4 30.3,71.09 R14.1
N$27
  Top 0.254: X4.2 33.02,76.2 32.38,75.56 30.48,75.56 29.84,74.93 R14.2
NRF_CE  (via drill 0.5)
  Top 0.254: v38.1,52.07 PI1.11
  Bottom 0.254: U8.3 7.3,53.66 8.89,52.07 v38.1,52.07
ROUT
  Top 0.254: U4.7 68.88,66.06 70.8,64.14 82.55,64.14 83.82,62.87 83.82,54.29 84.67,53.44 C13.1
SCL  (via drill 0.5)
  Top 0.203: U2.2 9.12,47.86 8.89,47.62 8.89,46.04 v9.84,45.09 9.64,44.88 U1.2 | v5.71,34.61 U3.15 v5.71,30.48 | v30.48,30.48 PI1.5
  Bottom 0.203: v5.71,34.61 5.71,40.96 v9.84,45.09 | v5.71,30.48 v30.48,30.48
SDA  (via drill 0.5)
  Top 0.203: U2.10 7.46,47.46 7.3,47.31 v7.3,45.09 8.14,44.25 U1.4 | v4.45,34.61 U3.16 v4.45,29.21 | v27.94,29.21 PI1.3
  Bottom 0.203: v4.45,34.61 4.45,42.23 v7.3,45.09 | v4.45,29.21 v27.94,29.21
SPI_CE0  (via drill 0.5)
  Top 0.254: v56.2,59.69 56.2,26.99 54.61,25.4 54.61,22.86 PI1.24
  Bottom 0.254: U8.4 7.3,58.1 8.89,59.69 v56.2,59.69
SPI_MISO  (via drill 0.5)
  Top 0.254: v53.02,54.61 53.02,30.48 52.39,29.84 52.39,28.26 50.8,26.67 PI1.21
  Bottom 0.254: U8.7 v53.02,54.61
SPI_MOSI  (via drill 0.5)
  Top 0.254: v48.58,58.42 48.58,24.45 PI1.19
  Bottom 0.254: U8.6 9.84,58.1 10.16,58.42 v48.58,58.42
SPI_SCLK  (via drill 0.5)
  Top 0.254: v55.24,53.34 55.24,29.84 53.34,27.94 PI1.23
  Bottom 0.254: U8.5 9.84,53.66 10.16,53.34 v55.24,53.34
VCC  (via drill 0.5)
  Top 0.254: U4.1 72.78,69.28 73.03,69.53 v73.03,69.85 C12.1 | U4.8 68.22,68.62 66.36,70.48 C8.1 65.51,71.54 65.41,71.44 C9.1 | C9.1 | U4.20 72.78,60.26 73.03,60.01 v73.03,59.37 C6.1 | C9.1 v64.14,69.85 63.5,69.85 63.18,69.53 63.18,68.09 | R11.1 68.58,58.1 v67.63,59.05 | U5.5 62.55,60.32 63.18,60.96 63.18,62.23 | 63.18,62.23 C17.1 | 63.18,62.23 63.18,64.45 | 63.18,64.45 63.18,68.09 | 63.18,68.09 C18.+ | 63.18,64.45 C16.1
  Bottom 0.254: v73.03,59.37 v73.03,69.85 v64.14,69.85 64.14,62.55 v67.63,59.05
WIFI_CH_PD  (via drill 0.5)
  Top 0.254: v60.96,31.75 PI1.29 | v41.91,31.75 41.91,74.93 41.91,75.88 43.18,77.15 43.18,86.36 42.65,86.89 U7.3
  Bottom 0.254: v41.91,31.75 v60.96,31.75
WIFI_SD_CLK  (via drill 0.5)
  Top 0.254: R5.2 53.98,29.84 v53.34,29.21 | v43.81,29.21 43.81,27.3 43.18,26.67 PI1.15
  Bottom 0.254: v43.81,29.21 v53.34,29.21
WIFI_SD_CMD0
  Top 0.254: R13.2 42.86,27.62 41.91,26.67 41.91,22.86 PI1.16
WIFI_SD_D0
  Top 0.254: R6.2 45.09,27.3 44.45,26.67 44.45,22.86 PI1.18
WIFI_SD_D1
  Top 0.254: R7.2 51.75,28.89 49.53,26.67 49.53,22.86 PI1.22
WIFI_SD_D2  (via drill 0.5)
  Top 0.254: 47.31,26.99 R8.2 | v71.12,26.67 PI1.37
  Top 0.406: v46.99,26.67 47.31,26.99
  Bottom 0.254: v46.99,26.67 v71.12,26.67
WIFI_SD_D3  (via drill 0.5)
  Top 0.254: v49.53,27.94 R9.2 | PI1.13 v40.64,27.94
  Bottom 0.254: v40.64,27.94 v49.53,27.94
WS2812_3V3  (via drill 0.5)
  Top 0.254: U9.2 33.02,52.07 v34.29,50.8 | v62.23,50.8 62.23,22.86 PI1.32
  Bottom 0.254: v62.23,50.8 v34.29,50.8